# EAGLE board panel_controller_rev_c (EAGLE 9.6.2)
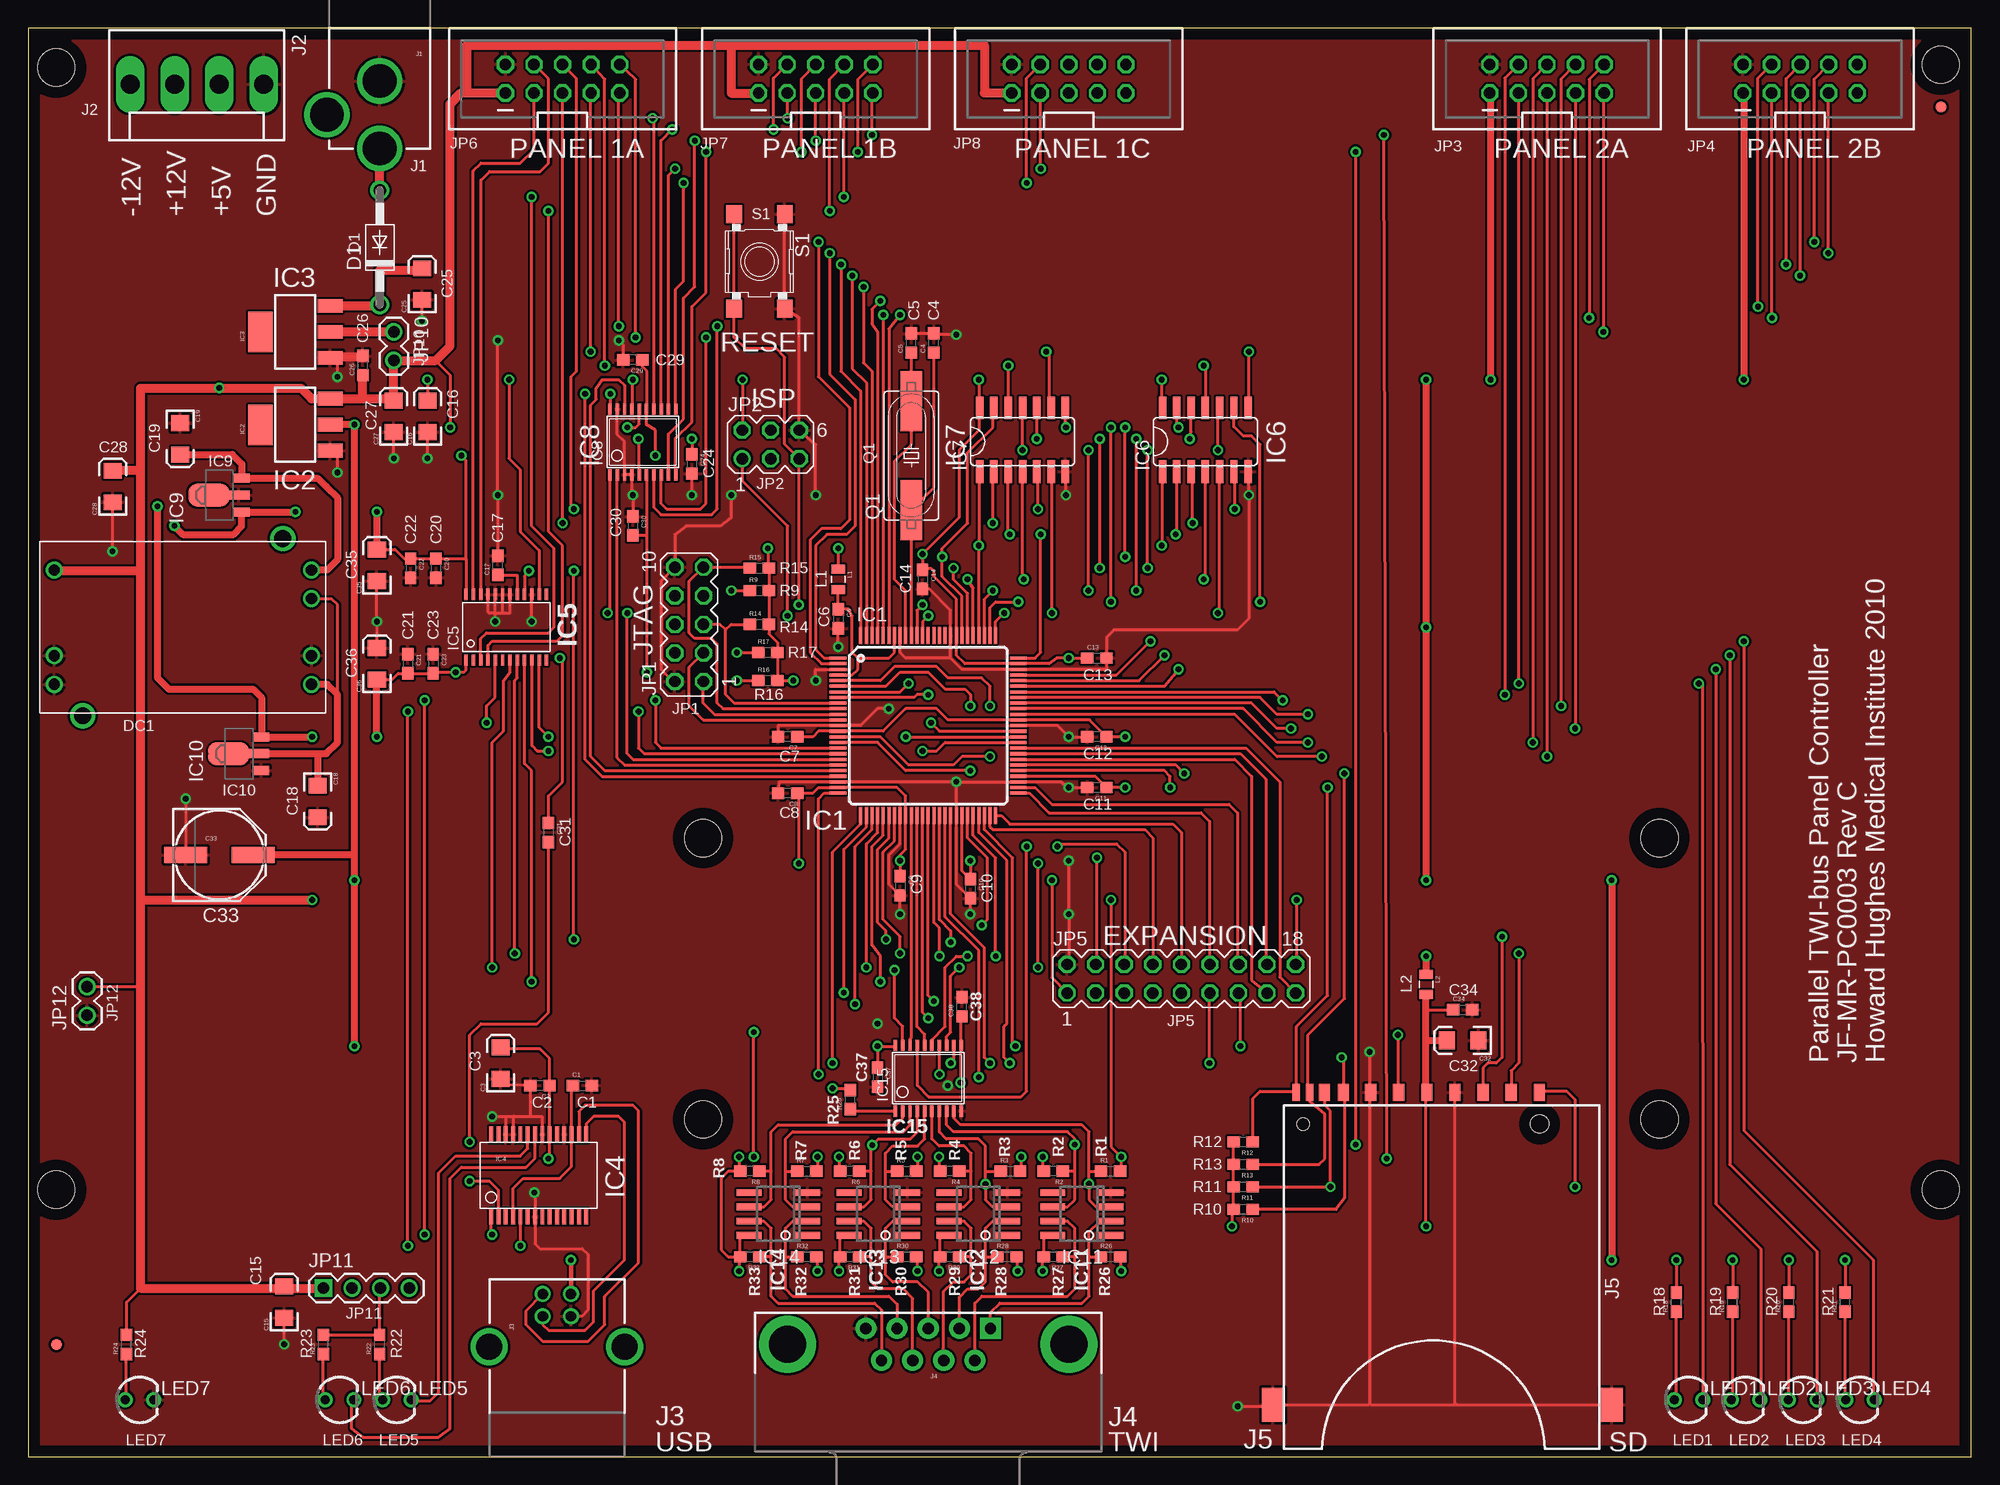
[diagram p2: board, top side]
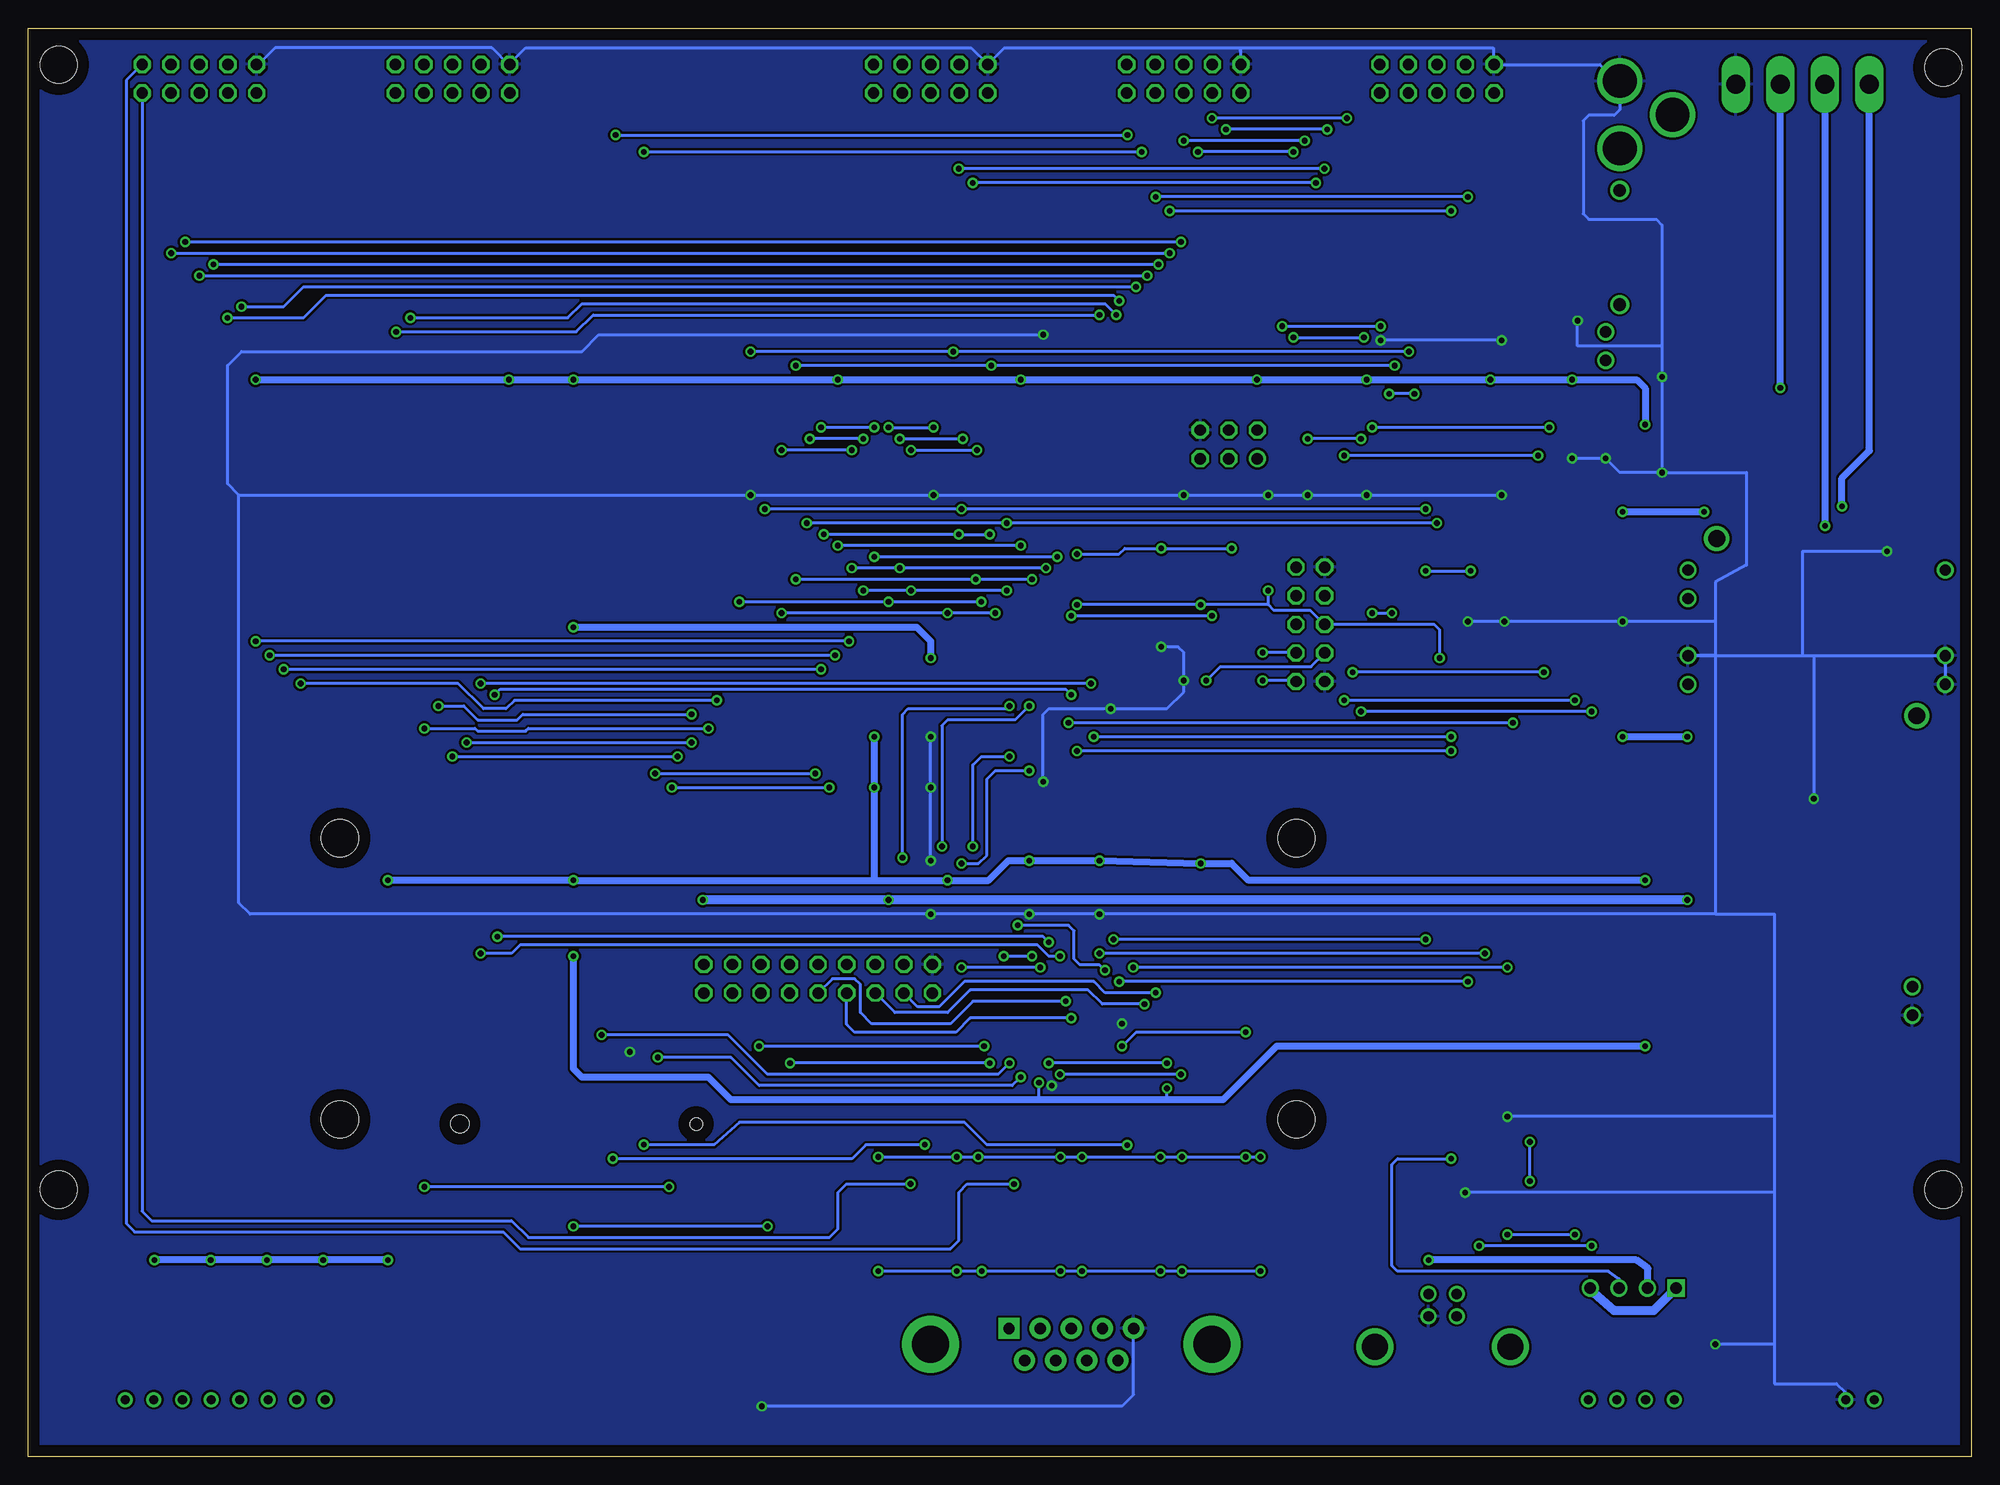
[diagram p3: board, bottom side, seen from below]

Size 172.72 x 127 mm. Coordinates in mm from the lower left corner, seen from the top.
Outline: 0,0 172.72,0 172.72,127 0,127 0,0
Copper layers (1*16): Top 0.035mm / dielectric 1.5mm / Bottom 0.035mm
Design rules "default *": minimum track width 10mil, minimum drill 15mil, track to track 8mil, track to pad 8mil, pad to pad 8mil, via to via 8mil, smd to smd 8mil, copper to edge 40mil, drill to drill 8mil, minimum pad ring 10mil, minimum via ring 8mil, stop-mask expansion 4mil, vias tented up to drill 0mil, thermal gap 10mil
Net classes: 0 default: width 0.203 mm; 1 power: width 0.254 mm

## Footprints (pad centres in the part's own frame; a part is rotated, then mirrored left to right if it is on the bottom)
0603 = smd 1.1 x 1: 1 -0.85,0; 2 0.85,0
EIA3216 = smd 1.4 x 1.6: A 1.4,0; C -1.4,0
PANASONIC_E = smd 3.8 x 1.4: + 3,0; - -3,0
DO41-10 = drill 1.118: A 5.08,0; C -5.08,0
CC3-TH = drill 1: 1 -11.43,5.08; 2 -11.43,-2.54; 3 -11.43,-5.08; 4 11.43,-5.08; 5 11.43,-2.54; 6 11.43,2.54; 7 11.43,5.08 | drill 1.5: P$8 -8.89,-7.874; P$9 8.89,7.874
TQFP100 = smd 1.5 x 0.27: 1 -8,6; 2 -8,5.5; 3 -8,5; 4 -8,4.5; 5 -8,4; 6 -8,3.5; 7 -8,3; 8 -8,2.5; 9 -8,2; 10 -8,1.5; 11 -8,1; 12 -8,0.5; 13 -8,0; 14 -8,-0.5; 15 -8,-1; 16 -8,-1.5; 17 -8,-2; 18 -8,-2.5; 19 -8,-3; 20 -8,-3.5; 21 -8,-4; 22 -8,-4.5; 23 -8,-5; 24 -8,-5.5; 25 -8,-6; 51 8,-6; 52 8,-5.5; 53 8,-5; 54 8,-4.5; 55 8,-4; 56 8,-3.5; 57 8,-3; 58 8,-2.5; 59 8,-2; 60 8,-1.5; 61 8,-1; 62 8,-0.5; 63 8,0; 64 8,0.5; 65 8,1; 66 8,1.5; 67 8,2; 68 8,2.5; 69 8,3; 70 8,3.5; 71 8,4; 72 8,4.5; 73 8,5; 74 8,5.5; 75 8,6 | smd 0.27 x 1.5: 26 -6,-8; 27 -5.5,-8; 28 -5,-8; 29 -4.5,-8; 30 -4,-8; 31 -3.5,-8; 32 -3,-8; 33 -2.5,-8; 34 -2,-8; 35 -1.5,-8; 36 -1,-8; 37 -0.5,-8; 38 0,-8; 39 0.5,-8; 40 1,-8; 41 1.5,-8; 42 2,-8; 43 2.5,-8; 44 3,-8; 45 3.5,-8; 46 4,-8; 47 4.5,-8; 48 5,-8; 49 5.5,-8; 50 6,-8; 76 6,8; 77 5.5,8; 78 5,8; 79 4.5,8; 80 4,8; 81 3.5,8; 82 3,8; 83 2.5,8; 84 2,8; 85 1.5,8; 86 1,8; 87 0.5,8; 88 0,8; 89 -0.5,8; 90 -1,8; 91 -1.5,8; 92 -2,8; 93 -2.5,8; 94 -3,8; 95 -3.5,8; 96 -4,8; 97 -4.5,8; 98 -5,8; 99 -5.5,8; 100 -6,8
SOT223 = smd 1.219 x 2.235: 1 -2.311,-3.099; 2 0,-3.099; 3 2.311,-3.099 | smd 3.6 x 2.2: 4 0,3.099
SSOP28DB = smd 0.348 x 1.397: 1 -4.225,-3.656; 2 -3.575,-3.656; 3 -2.925,-3.656; 4 -2.275,-3.656; 5 -1.625,-3.656; 6 -0.975,-3.656; 7 -0.325,-3.656; 8 0.325,-3.656; 9 0.975,-3.656; 10 1.625,-3.656; 11 2.275,-3.656; 12 2.925,-3.656; 13 3.575,-3.656; 14 4.225,-3.656; 15 4.225,3.656; 16 3.575,3.656; 17 2.925,3.656; 18 2.275,3.656; 19 1.625,3.656; 20 0.975,3.656; 21 0.325,3.656; 22 -0.325,3.656; 23 -0.975,3.656; 24 -1.625,3.656; 25 -2.275,3.656; 26 -2.925,3.656; 27 -3.575,3.656; 28 -4.225,3.656
TSSOP24 = smd 0.305 x 0.991: 1 -3.575,-2.918; 2 -2.925,-2.918; 3 -2.275,-2.918; 4 -1.625,-2.918; 5 -0.975,-2.918; 6 -0.325,-2.918; 7 0.325,-2.918; 8 0.975,-2.918; 9 1.625,-2.918; 10 2.275,-2.918; 11 2.925,-2.918; 12 3.575,-2.918; 13 3.575,2.918; 14 2.925,2.918; 15 2.275,2.918; 16 1.625,2.918; 17 0.975,2.918; 18 0.325,2.918; 19 -0.325,2.918; 20 -0.975,2.918; 21 -1.625,2.918; 22 -2.275,2.918; 23 -2.925,2.918; 24 -3.575,2.918
SO014 = smd 0.66 x 2.032: 1 -3.175,-2.68; 2 -1.905,-2.68; 3 -0.635,-2.68; 4 0.635,-2.68; 5 1.905,-2.68; 6 3.175,-2.68; 7 4.445,-2.68; 8 4.445,2.997; 9 3.175,2.997; 10 1.905,2.997; 11 0.635,2.997; 12 -0.635,2.997; 13 -1.905,2.997; 14 -3.175,2.997
TSSOP20 = smd 0.305 x 0.991: 1 -2.925,-2.918; 2 -2.275,-2.918; 3 -1.625,-2.918; 4 -0.975,-2.918; 5 -0.325,-2.918; 6 0.325,-2.918; 7 0.975,-2.918; 8 1.625,-2.918; 9 2.275,-2.918; 10 2.925,-2.918; 11 2.925,2.918; 12 2.275,2.918; 13 1.625,2.918; 14 0.975,2.918; 15 0.325,2.918; 16 -0.325,2.918; 17 -0.975,2.918; 18 -1.625,2.918; 19 -2.275,2.918; 20 -2.925,2.918
SOT89 = smd 0.8 x 1.4: 1 -1.499,-1.981; 3 1.499,-1.981 | smd 0.8 x 1.9: 2 0,-1.727 | smd 2.032 x 3.65: 2@1 0,0.94
SO08 = smd 0.6 x 2.2: 1 -1.905,-2.6; 2 -0.635,-2.6; 3 0.635,-2.6; 4 1.905,-2.6; 5 1.905,2.6; 6 0.635,2.6; 7 -0.635,2.6; 8 -1.905,2.6
POWER_JACK_PTH = drill 2.997: GND 0,7.7; GNDBREAK 4.7,10.7; PWR 0,13.7
KK-156-4 = drill 1.7 pad 2.184 long: 1 -5.94,0; 2 -1.98,0; 3 1.98,0; 4 5.94,0
USB-B-PTH = drill 0.914: D+ 0,1.25; D- 1.981,1.25; GND 0,-1.25; VBUS 1.981,-1.25 | drill 2.286: P$1 -2.718,-6.02; P$2 -2.718,6.02
DB9 = drill 1.016 pad 1.88 square: 1 -5.54,-1.42 | drill 1.016 pad 1.88: 2 -2.77,-1.42; 3 0,-1.42; 4 2.77,-1.42; 5 5.54,-1.42; 6 -4.15,1.42; 7 -1.38,1.42; 8 1.38,1.42; 9 4.15,1.42 | drill 3.302 pad 5.08: G1 -12.5,0; G2 12.5,0
SD-MMC_SOCKET-3M = smd 1 x 1.5: 1 6.88,29.85; 2 4.38,29.85; 3 1.88,29.85; 4 -0.62,29.85; 5 -3.12,29.85; 6 -5.62,29.85; 7 -8.04,29.85; 8 -9.728,29.85; 9 9.38,29.85 | smd 2 x 3: 12 -14.28,2.1; 13 15.822,2.095 | smd 0.7 x 1.5: CD -11.03,29.855; WP -12.23,29.85 | hole 1.1: -11.6,27.05 | hole 1.6: 9.4,27.05
MA05-2 = drill 1.016 octagon: 1 -5.08,-1.27; 2 -5.08,1.27; 3 -2.54,-1.27; 4 -2.54,1.27; 5 0,-1.27; 6 0,1.27; 7 2.54,-1.27; 8 2.54,1.27; 9 5.08,-1.27; 10 5.08,1.27
MA03-2 = drill 1.016: 1 -2.54,-1.27 | drill 1.016 octagon: 2 -2.54,1.27; 3 0,-1.27; 4 0,1.27; 5 2.54,-1.27; 6 2.54,1.27
2X5-SHROUDED = drill 1.016 octagon: 1 -1.27,5.08; 2 1.27,5.08; 3 -1.27,2.54; 4 1.27,2.54; 5 -1.27,0; 6 1.27,0; 7 -1.27,-2.54; 8 1.27,-2.54; 9 -1.27,-5.08; 10 1.27,-5.08
MA09-2 = drill 1.016 octagon: 1 -10.16,-1.27; 2 -10.16,1.27; 3 -7.62,-1.27; 4 -7.62,1.27; 5 -5.08,-1.27; 6 -5.08,1.27; 7 -2.54,-1.27; 8 -2.54,1.27; 9 0,-1.27; 10 0,1.27; 11 2.54,-1.27; 12 2.54,1.27; 13 5.08,-1.27; 14 5.08,1.27; 15 7.62,-1.27; 16 7.62,1.27; 17 10.16,-1.27; 18 10.16,1.27
1X02 = drill 1.016: 1 0,0; 2 2.54,0
1X04 = drill 1.016 square: 1 0,0 | drill 1.016: 2 2.54,0; 3 5.08,0; 4 7.62,0
0805 = smd 0.8 x 1.2: 1 -0.9,0; 2 0.9,0
LED3MM = drill 0.813: A -1.27,0; K 1.27,0
HC49UP = smd 5.334 x 1.93: 1 -4.826,0; 2 4.826,0
OMRON = smd 1.6 x 1.4: 1 -4.2,2.25; 2 4.2,2.25; 3 -4.2,-2.25; 4 4.2,-2.25
FIDUCIAL-1X2 = smd 1 x 1: 1 0,0
STAND-OFF = hole 3.302: 0,0

## Placement (x,y rotation side)
C1  .1uf  [0603]  49.25,33 0 top
C2  .1uf  [0603]  45.5,33 180 top
C3  10uf  [EIA3216]  42,35 90 top
C4  22pf  [0603]  80.5,99 90 top
C5  22pf  [0603]  78.5,99 90 top
C6  .1uf  [0603]  72,74.5 270 top
C7  .1uf  [0603]  67.5,64 180 top
C8  .1uf  [0603]  67.5,59 180 top
C9  .1uf  [0603]  77.5,50.75 270 top
C10  .1uf  [0603]  83.75,50.5 270 top
C11  .1uf  [0603]  95,59.5 180 top
C12  .1uf  [0603]  95,64 180 top
C13  .1uf  [0603]  95,71 0 top
C14  .1uf  [0603]  79.5,78 270 top
C15  10uf  [EIA3216]  22.75,13.75 90 top
C16  10uf  [EIA3216]  35.5,92.5 90 top
C17  .01uf  [0603]  41.75,79.25 90 top
C18  10uf  [EIA3216]  25.75,58.25 270 top
C19  10uf  [EIA3216]  13.5,90.5 270 top
C20  .1uf  [0603]  36.25,79 270 top
C21  .1uf  [0603]  33.75,70.5 270 top
C22  22pf  [0603]  34,79 270 top
C23  22pf  [0603]  36,70.5 270 top
C24  680pf  [0603]  59,88.25 270 top
C25  10uf  [EIA3216]  35,104.25 90 top
C26  .1uf  [0603]  29.75,97 90 top
C27  10uf  [EIA3216]  32.5,92.5 90 top
C28  10uf  [EIA3216]  7.5,86.25 90 top
C29  .1uf  [0603]  53.75,97.5 180 top
C30  .1uf  [0603]  53.75,82.75 270 top
C31  .1uf  [0603]  46.25,55.5 270 top
C32  10uf  [EIA3216]  127.5,37 180 top
C33  100uf  [PANASONIC_E]  17,53.5 0 top
C34  .1uf  [0603]  127.5,39.75 0 top
C35  10uf  [EIA3216]  31,79.25 90 top
C36  10uf  [EIA3216]  31,70.5 90 top
C37  .1uf  [0603]  75.5,33.75 270 top
C38  .1uf  [0603]  83,40 90 top
D1  1N4004  [DO41-10]  31.25,107.5 90 top
DC1  CC3-0512DF-E  [CC3-TH]  13.75,73.75 0 top
IC1  AVR_XMEGA_A1_100A  [TQFP100]  80,65 0 top
IC2  LM1117-3.3  [SOT223]  23.75,91.75 90 top
IC3  LM1117-5  [SOT223]  23.75,100 90 top
IC4  FT232RL-BASICSSOP  [SSOP28DB]  45.38,25.01 0 top
IC5  AD5724SSOP  [TSSOP24]  42.5,73.75 0 top
IC6  74LVC125SO  [SO014]  104,90.25 0 top
IC7  74LVC126SO  [SO014]  87.75,90.25 0 top
IC8  AD7328SSOP  [TSSOP20]  54.64,90.21 0 top
IC9  78L12  [SOT89]  17,85.5 90 top
IC10  79L12  [SOT89]  18.75,62.5 90 top
IC11  82B715TD  [SO08]  93.66,21.59 90 top
IC12  82B715TD  [SO08]  84.45,21.59 90 top
IC13  82B715TD  [SO08]  75.56,21.59 90 top
IC14  82B715TD  [SO08]  66.67,21.59 90 top
IC15  PCA9519  [TSSOP20]  80.01,33.66 0 top
J1  POWER_JACKPTH  [POWER_JACK_PTH]  31.25,130 180 top
J2  [KK-156-4]  15,122 180 top
J3  USBPTH  [USB-B-PTH]  47,12.5 90 top
J4  [DB9]  80,10 180 top
J5  SD-CARD-SOCKET  [SD-MMC_SOCKET-3M]  124.94,2.54 0 top
JP1  M05X2PTH  [MA05-2]  58.75,74 90 top
JP2  PDI  [MA03-2]  66,90 0 top
JP3  M05X2SHD  [2X5-SHROUDED]  135,122.5 90 top
JP4  M05X2SHD  [2X5-SHROUDED]  157.5,122.5 90 top
JP5  [MA09-2]  102.5,42.5 0 top
JP6  M05X2SHD  [2X5-SHROUDED]  47.5,122.5 90 top
JP7  M05X2SHD  [2X5-SHROUDED]  70,122.5 90 top
JP8  M05X2SHD  [2X5-SHROUDED]  92.5,122.5 90 top
JP10  [1X02]  32.5,100 270 top
JP11  [1X04]  26.25,15 0 top
JP12  [1X02]  5.25,39.25 90 top
L1  10uH  [0805]  72,78 270 top
L2  22uH  [0805]  124.25,42 270 top
LED1  [LED3MM]  147.57,5.08 0 top
LED2  [LED3MM]  152.65,5.08 0 top
LED3  [LED3MM]  157.73,5.08 0 top
LED4  [LED3MM]  162.81,5.08 0 top
LED5  [LED3MM]  32.77,5.08 0 top
LED6  [LED3MM]  27.69,5.08 0 top
LED7  PWR  [LED3MM]  9.91,5.08 0 top
Q1  8MHz  [HC49UP]  78.5,89 90 top
R1  2.2K  [0603]  96.2,25.4 0 top
R2  2.2K  [0603]  91.12,25.4 180 top
R3  2.2K  [0603]  87.31,25.4 0 top
R4  2.2K  [0603]  81.92,25.4 180 top
R5  2.2K  [0603]  78.11,25.4 0 top
R6  2.2K  [0603]  73.03,25.4 180 top
R7  2.2K  [0603]  69.22,25.4 0 top
R8  2.2K  [0603]  64.14,25.4 180 top
R9  10K  [0603]  65,77 0 top
R10  100K  [0603]  108,22 180 top
R11  100K  [0603]  108,24 180 top
R12  100K  [0603]  108,28 180 top
R13  100K  [0603]  108,26 180 top
R14  10K  [0603]  65,74 0 top
R15  10K  [0603]  65,79 0 top
R16  10K  [0603]  65.75,69 0 top
R17  10K  [0603]  65.75,71.5 0 top
R18  100  [0603]  146.5,13.75 90 top
R19  100  [0603]  151.5,13.75 90 top
R20  100  [0603]  156.5,13.75 90 top
R21  100  [0603]  161.5,13.75 90 top
R22  330  [0603]  31.25,10 90 top
R23  330  [0603]  26.25,10 90 top
R24  330  [0603]  8.75,10 90 top
R25  10K  [0603]  73.06,31.75 90 top
R26  470  [0603]  96.2,17.78 0 top
R27  470  [0603]  91.12,17.78 180 top
R28  470  [0603]  87,17.78 0 top
R29  470  [0603]  81.92,17.78 180 top
R30  470  [0603]  78.11,17.78 0 top
R31  470  [0603]  73.03,17.78 180 top
R32  470  [0603]  69.22,17.78 0 top
R33  470  [0603]  64.14,17.78 180 top
S1  [OMRON]  65,106.25 270 top
U$1  FIDUCIAL1X2  [FIDUCIAL-1X2]  2.5,10 0 top
U$2  FIDUCIAL1X2  [FIDUCIAL-1X2]  170,120 0 top
U$3  STAND-OFF  [STAND-OFF]  2.5,123.5 0 top
U$4  STAND-OFF  [STAND-OFF]  170,123.75 0 top
U$5  STAND-OFF  [STAND-OFF]  2.5,23.75 0 top
U$6  STAND-OFF  [STAND-OFF]  170,23.75 0 top
U$7  STAND-OFF  [STAND-OFF]  60,55 0 top
U$8  STAND-OFF  [STAND-OFF]  60,30 0 top
U$9  STAND-OFF  [STAND-OFF]  145,30 0 top
U$10  STAND-OFF  [STAND-OFF]  145,55 0 top

## Tracks (layer width: path | path; a pad name or v marks a point on that pad's centre or on a via)
+3V3  (via drill 0.51)
  Top 0.254: v146.5,17.5 R18.2 | v151.5,17.5 R19.2 | v156.5,17.5 R20.2 | v161.5,17.5 R21.2 | IC1.44 83,52.1 C10.1 v83.75,53 | IC1.54 94.85,60.5 C11.1 v97.5,59.5 | C13.1 v92.5,71 91.4,71 90.75,70.5 IC1.74 83.25,70.5 82.5,71.25 IC1.83 82.5,76.25 80.5,78.25 80.5,78.75 80.25,79 79.75,79 C14.1 v79.5,80.25 82.75,83.5 82.75,89.5 84.5,91.25 84.5,93.17 IC7.14 84.5,93.32 v84.5,95.75 | v72,80.75 L1.1 | IC6.14 100.75,93.32 v100.75,95.75 | C9.1 v77.5,53 77.5,53.5 78,54 IC1.34 78,58.75 77.25,59.5 IC1.24 70.25,59.5 69.75,59 C8.1 68.5,58.85 v68.5,52.75 | JP5.1 91,42.61 v91,51.25 | v124.25,51.25 124.32,51.18 | v97.5,64 C12.1 94.35,65.5 IC1.64 81.75,65.5 80.75,66.5 78,66.5 76,64.5 IC1.14 70.25,64.5 69.75,64 C7.1 | JP4.1 152.5,121.15 | 130,121.15 JP3.1 | v63.5,95.75 63.5,91.31 JP2.2 | IC8.17 53.66,95.67 v53.75,95.75 | v65.75,80.75 65.75,79.1 R15.2 R9.2 R14.2 65.85,73.15 66.6,72.4 R17.2 R16.2 v68,69 | v35.5,95.75 C16.A | v42.75,95.75 42.75,88.75 43.75,87.75 43.75,82.25 45.42,80.58 IC5.14 | v82.87,33.27 82.94,33.34 IC15.11 82.94,39.09 C38.1 | R25.2 72.92,32.75 v71.5,32.75
  Top 0.61: v124.25,95.75 v124.25,73.75 v124.25,51.25 | 152.5,121.15 v152.5,95.75 | v130,95.75 130,121.15 | 29,53.5 v29,51.25 v29,36.5 | 29,53.5 v29,91.75 IC2.2 | 29,53.5 C33.+ | 124.32,51.18 124.25,51.18 | v140.75,51.25 v140.75,17.5 | v124.25,44.5 L2.1
  Bottom 0.254: v79.5,80.25 75.75,80.25 75.25,80.75 v72,80.75 v65.75,80.75 | v68,69 66.75,70.25 58.69,70.25 JP1.4 | 82.87,31.75 v82.87,33.27 | 71.5,31.75 v71.5,32.75
  Bottom 0.61: v140.75,17.5 v146.5,17.5 v151.5,17.5 v156.5,17.5 v161.5,17.5 | v152.5,95.75 v130,95.75 v124.25,95.75 v100.75,95.75 v84.5,95.75 v63.5,95.75 v53.75,95.75 v42.75,95.75 v35.5,95.75 29.75,95.75 29,95 v29,91.75 | 97.5,51.25 v124.25,51.25 v140.75,51.25 | 97.5,51.25 v91,51.25 87.34,51.25 85.59,53 v83.75,53 v77.5,53 v68.5,52.75 65.75,52.75 64.25,51.25 v29,51.25 | v97.5,64 v97.5,59.5 97.5,51.25 | v124.25,73.75 93.75,73.75 92.5,72.5 v92.5,71 | v124.25,44.5 124.25,34.5 123.5,33.75 112.25,33.75 110.25,31.75 82.87,31.75 71.5,31.75 66.5,31.75 61.75,36.5 v29,36.5
+5V  (via drill 0.51)
  Top 0.254: 32.34,94.06 C27.A | 27.69,94.06 IC2.3 | C15.A 22.65,15 23.25,15 | 42.4,121.25 JP6.1 | IC8.16 54.31,91.81 54,91.5 v53.25,91.5 | v37.5,91.5 37.5,96.17 36.21,97.46 | v112.75,49.5 112.75,43.86 JP5.18 | R24.2 8.75,13.75 10,15 | JP12.2 9.96,41.79 10,41.75 | R26.2 97.16,17.68 v97.16,16.51 | v63.18,16.51 63.18,17.68 R33.2 | v72.07,16.51 72.07,17.68 R31.2 72.17,19.68 IC13.8 | v80.96,16.51 80.96,17.68 R29.2 81.06,19.68 IC12.8 | v90.17,16.51 90.17,17.68 R27.2 90.27,19.68 IC11.8 | R32.2 70.17,17.68 v70.17,16.51 | R30.2 79.06,17.68 v79.06,16.51 | R28.2 87.95,17.68 v87.95,16.51 | R1.2 97.16,25.5 v97.16,26.67 96.25,27.57 v96.25,49.5 | v63.18,26.67 63.18,25.4 R8.2 62.23,25.4 61.59,24.77 61.59,18.41 62.23,17.78 R33.2 | R7.2 70.17,25.4 v70.17,26.67 | R6.2 72.07,25.4 v72.07,26.67 | R5.2 79.06,25.4 v79.06,26.67 | R4.2 80.96,25.4 v80.96,26.67 | R3.2 88.27,25.4 v88.27,26.67 | R2.2 90.17,25.4 v90.17,26.67 | IC15.20 arc-90 77.01,36.5 v75.5,36.5 C37.1 | v64.5,26.67 v64.5,37.75 | IC14.8 63.28,19.68 R33.2
  Top 0.61: 17,95 v16.98,95.02
  Top 0.813: 29.75,94.06 27.69,94.06 25.19,94.06 24.25,95 17,95 10,95 10,87.75 | 29.75,94.06 32.34,94.06 | C27.A JP10.2 36.21,97.46 37.5,98.75 37.5,120.25 38.5,121.25 38.75,121.25 | 29.75,94.06 C26.1 | JP11.1 23.25,15 10,15 10,41.75 10,49.5 | 38.75,121.25 42.4,121.25 | 10,49.5 v25.25,49.5 | 38.75,121.25 39,121.25 39,125.5 62.5,125.5 | 62.5,125.5 85,125.5 85,121.25 87.42,121.25 JP8.1 | JP7.1 62.5,121.23 62.5,125.5 | 10,49.5 10,78.75 | 10,78.75 10,87.75 | 10,78.75 2.4,78.75 DC1.1 | C28.A 9.9,87.65 10,87.75
  Bottom 0.254: 33.87,14.87 JP11.4 | v37.5,91.5 v53.25,91.5 | JP8.1 87.42,121.33 | v63.18,16.51 v70.17,16.51 v72.07,16.51 v79.06,16.51 v80.96,16.51 v87.95,16.51 v90.17,16.51 v97.16,16.51 | v63.18,26.67 v64.5,26.67 v70.17,26.67 v72.07,26.67 v79.06,26.67 v80.96,26.67 v88.27,26.67 v90.17,26.67 v97.16,26.67 | v75.5,36.5 74.25,37.75 v64.5,37.75
  Bottom 0.61: v16.98,95.02 J2.2
  Bottom 0.813: 33.87,14.87 31.75,13 28.25,13 JP11.1 | v25.25,49.5 v96.25,49.5 v112.75,49.5
+12V  (via drill 0.51)
  Top 0.254: v55.75,89 55.75,91.25 54.97,91.75 IC8.15 55,93.16 55,96.5 54.6,96.9 C29.1 | 38.92,79.75 IC5.24 | 38.92,79.75 arc90 38.83,79.85 C20.1 C22.1 33.4,79.85 32.6,80.65 C35.A | 38.92,79.75 38.92,88.58 v38.5,89
  Top 0.61: v23.75,84 IC9.1 18.98,82.73 18.25,82 13.75,82 v13,82.75 | v31,84 C35.A
  Bottom 0.254: v38.5,89 v55.75,89
  Bottom 0.61: v23.75,84 v31,84 | v13,82.75 13,121.98 J2.3
+15V
  Top 0.61: DC1.7 26.58,78.83 27.5,79.75 27.5,85.25 26.5,86.25 25.73,87 IC9.3 19,87.02 19,88.25 18.15,89.1 C19.A
-12V  (via drill 0.51)
  Top 0.254: IC8.6 55,87.26 55,82 | v55,69.75 55,82 | IC5.1 38.92,69.92 38.75,69.75 v38,69.75 36.1,69.75 C23.2 C21.2 32.9,69.65 32.35,69.1 C36.C | C30.2 54.9,81.9 55,82
  Top 0.61: v25.25,64 IC10.3 20.75,64.02 20.75,67.5 20,68.25 12.5,68.25 11.5,69.25 v11.5,84.5 | v31,64 C36.C
  Bottom 0.254: v38,69.75 v55,69.75
  Bottom 0.61: v25.25,64 v31,64 | J2.4 9.06,89.44 11.5,87 v11.5,84.5
-15V
  Top 0.254: DC1.6 25.22,76.25 27,76.25 27.5,75.75 27.5,67.75
  Top 0.61: DC1.4 26.58,68.67 27.5,67.75 27.5,63.5 26.5,62.5 25.75,62.5 | IC10.2 25.75,62.5 | 25.75,62.5 C18.C
GND  (via drill 0.51)
  Top 0.254: 119.25,32.32 J5.6 | 119.25,4.75 119.25,32.32 | 119.25,4.75 119.14,4.64 J5.12 110.52,4.5 v107.5,4.5 | 140.65,4.75 J5.13 127,4.63 | 119.25,4.75 119.36,4.63 127,4.63 | J5.3 126.82,4.63 127,4.63 | 82.5,56.75 82.5,50.9 C10.2 v83.75,48.25 | 82.5,56.75 IC1.43 | 119.25,32.32 v119.25,36 | JP5.2 92.5,43.89 v92.5,48.25 v92.5,53 | C14.2 80.1,77.15 82,75.25 IC1.84 82,71 | 82,71 83,70 IC1.73 95.85,70 C13.2 95.85,72.85 96.5,73.5 107.5,73.5 108.5,74.5 v108.5,85.5 108.5,87.52 IC6.7 | IC1.93 77.5,71.5 78,71 82,71 | IC7.7 92.25,87.52 v92.25,85.5 | C5.2 C4.2 80.6,99.75 v82.5,99.75 | IC1.33 77.5,54.5 76.5,53.5 76.5,50.9 C9.2 v77.5,48.25 | C11.2 v92.5,59.5 91.75,60 IC1.53 v82.5,60 | IC1.63 91.5,65 v92.5,64 C12.2 | C8.2 66.65,59.15 66.75,60 IC1.23 v82.5,60 | 82.5,56.75 v82.5,60 | v70,85.5 70,89.98 JP2.6 68.54,101.26 S1.2 S1.1 | v59,85.5 C24.2 | IC8.19 52.37,90.89 53.02,90.23 IC8.3 IC8.4 53.66,85.58 v53.75,85.5 C30.1 | C7.2 66.65,65 IC1.13 74,65 75.5,66.5 v76.5,66.5 | JP1.2 57.33,68.92 56.25,70 56.25,77.85 JP1.10 57.5,79.1 57.5,82 58.5,82.75 61.5,82.75 62.5,83.5 v62.5,85.5 | C17.2 v41.75,85.5 v41.75,99.25 | v27.5,87.5 27.5,89.29 IC2.1 | v32.5,88.75 C27.C | IC3.1 27.5,97.79 v27.5,96 | v35.5,88.75 C16.C | IC5.15 44.75,76.64 v44.75,74.25 | 41.5,75 41,75 40.88,75.12 IC5.21 | 41.5,75 42.25,75 | IC5.20 41.5,76.64 41.5,75 | IC5.19 42.17,75 42.25,75 | IC5.18 42.83,75 42.25,75 | v41.5,74.25 41.5,75 | 29.31,97.79 C26.2 | v22.75,10 C15.C | C3.C 42.1,33.05 C2.2 44.65,30.25 44.75,30.25 | IC4.21 45.7,30.25 44.75,30.25 | 43.25,30.25 42.5,30.25 42.5,28.67 IC4.26 42.45,30.25 v41.25,30.25 | 43.25,30.25 44.75,30.25 | IC4.25 43.1,30.25 43.25,30.25
  Top 0.254: v45,23.5 45.05,23.5 IC4.7 45.05,18.95 45.5,18.5 49.25,18.5 49.75,18 49.75,13.06 49.25,12.5 J3.GND | v35,101 C25.C | v72,72 C6.2 | IC1.3 70,70 v70,69 | v7.5,80.5 C28.C | C29.2 52.9,98.85 v52.5,99.25 | C35.C v31,74.25 C36.A | v14,58.5 C33.-
  Top 0.813: 27.5,97.79 29.31,97.79
  Bottom 0.254: J4.5 74.46,5.54 75.5,4.5 v107.5,4.5 | v92.5,64 v92.5,59.5 v92.5,53 | v82.5,60 82.5,66 82,66.5 v76.5,66.5 71.5,66.5 70,68 v70,69 70,71.5 70.5,72 v72,72 | v41.75,85.5 v53.75,85.5 v59,85.5 v62.5,85.5 v70,85.5 v92.25,85.5 v108.5,85.5 154,85.5 | 22.75,48.25 v77.5,48.25 v83.75,48.25 v92.5,48.25 153,48.25 154,49.25 154,85.5 | 22.75,71.25 22.75,48.25 | 22.75,74.25 22.75,71.25 | 22.75,74.25 22.75,77.75 20,79.25 20,87.5 v27.5,87.5 | v27.5,87.5 31.25,87.5 v32.5,88.75 v35.5,88.75 | v27.5,87.5 v27.5,96 27.5,98.75 | 22.75,74.25 v31,74.25 31,74.5 31.25,74.25 v41.5,74.25 v44.75,74.25 | DC1.3 DC1.2 13.97,71.21 | 15,71.21 DC1.5 25.22,71.25 22.75,71.25 | 15,71.21 13.97,71.21 | 22.75,48.25 17.5,48.25 17.5,30.25 | 17.5,30.25 17.5,23.5 | 17.5,23.5 17.5,10 | 17.5,10 v22.75,10 | 17.5,30.25 v41.25,30.25 | 17.5,23.5 v45,23.5 | 152.25,123.75 150.75,125.25 131.5,125.25 130,123.75 128.5,125.25 88.9,125.25 JP8.2 85.94,125.25 65,125.25 64.92,123.92 JP7.2 64.92,125.25 42.5,125.25 42.5,123.77 JP6.2 42.4,123.75 33,123.75 32.5,123.25 J1.GND 31.25,119.75 31.75,119.25 34,119.25 34.5,118.75 34.5,110.5 34,110 28,110 27.5,109.5 27.5,98.75 | v82.5,99.75 122,99.75 123.5,98.25 153.75,98.25 155,97 155,86.5 154,85.5 | 15,71.21 15,80.5 v7.5,80.5 | LED7.K 11.27,5.77 12,6.5 17.5,6.5 17.5,10 | v41.75,99.25 v52.5,99.25 | v35,101 35,98.75 27.5,98.75 | 13.97,71.21 14,71.18 v14,58.5
  other vias: 81.75,33 75.5,38.5
  pour Top: 0,0 0,127 172.72,127 172.72,0
  pour Bottom: 0,0 0,127 172.72,127 172.72,0
JTAG-TCK  (via drill 0.51)
  Top 0.254: IC1.11 61,66 60,67 60,68.9 JP1.1 | v63,69 R16.1
  Bottom 0.254: v63,69 60.1,69 JP1.1
JTAG-TDI
  Top 0.254: IC1.10 61.75,66.5 61.25,67 61.25,72.25 60.75,72.75 59.25,72.75 58.75,73.25 58.75,77.85 JP1.9 64.07,79.08 R15.1
JTAG-TDO  (via drill 0.51)
  Top 0.254: IC1.12 60,65.5 58.75,66.75 58.75,70.19 JP1.3 | v63,71.5 R17.1
  Bottom 0.254: v63,71.5 60.06,71.5 JP1.3
JTAG-TMS
  Top 0.254: IC1.9 62.75,67 62,67.75 62,73.52 | 62,73.52 61.5,74 JP1.5 | R14.1 62.48,74 62,73.52
N$9
  Top 0.254: IC4.16 48.95,30.7 49.5,31.25 53.75,31.25 54.25,30.75 54.25,17.25 51.25,14.25 51.25,11.75 49.75,10.25 45.75,10.25 44.25,11.75 44.25,12.98 J3.D-
N$10
  Top 0.254: IC4.15 49.6,29.61 50.25,30.25 52.5,30.25 53,29.75 53,17.5 50.25,14.75 50.25,12 49.5,11.25 46.25,11.25 45.75,11.75 J3.D+
N$11  (via drill 0.51)
  Top 0.406: v48.25,17.5 J3.VBUS
  Bottom 0.254: JP11.2 28.75,15
  Bottom 0.61: v48.25,17.5 29.79,17.5 28.75,16.75 28.75,15
N$12
  Top 0.254: 48.3,32.91 C1.1 48.3,33 IC4.17 48.3,25.8 47.25,24.75 44,24.75 43.1,23.86 IC4.4
N$13  (via drill 0.51)
  Top 0.254: IC1.18 54.75,62.5 54.25,63 v54.25,66.25 | v33.75,18.75 v33.75,66.25 | v43.75,18.75 43.76,19.5 IC4.5
  Bottom 0.254: v33.75,66.25 v54.25,66.25 | v33.75,18.75 v43.75,18.75
N$14  (via drill 0.51)
  Top 0.254: IC1.19 53.75,62 53.25,62.5 v53.25,75 | v51.5,75 51.72,75.22 IC8.1
  Bottom 0.254: v53.25,75 v51.5,75
N$15
  Top 0.254: IC1.57 107.25,62 108.75,60.5 108.75,42.36 JP5.15
N$16  (via drill 0.51)
  Top 0.254: IC1.65 107.25,66 111,62.25 v115,62.25 | JP3.5 v135,62.25
  Bottom 0.254: v135,62.25 v115,62.25
N$17  (via drill 0.51)
  Top 0.254: IC1.67 108.75,67 111,64.75 v112.25,64.75 | v137.5,64.75 137.5,121.19 JP3.7
  Bottom 0.254: v137.5,64.75 133,64.75 132.75,64.5 128.5,64.5 128.25,64.75 v112.25,64.75
N$18  (via drill 0.51)
  Top 0.254: IC1.17 56.25,63 55.75,63.5 v55.75,67.25 | v35.25,19.75 v35.25,67.25 | 41.16,21.25 IC4.1 41.16,19.84 v41.25,19.75
  Bottom 0.254: v35.25,67.25 v55.75,67.25 | v35.25,19.75 v41.25,19.75
N$19
  Top 0.254: R22.1 31.23,9.15 31.23,5.37 LED5.A
N$20  (via drill 0.51)
  Top 0.254: 129.25,32.32 J5.2 129.32,34.57 129.75,35 130.5,35 131,35.5 v131,46.25 | v82,45.75 82,46.75 81,47.75 IC1.40
  Bottom 0.254: v82,45.75 82.5,46.25 v131,46.25
N$21  (via drill 0.51)
  Top 0.254: v84.5,33.75 84.5,45 81.5,48 IC1.41 | R10.1 116.25,22 117,23 117,32.29 J5.7 116.9,35.35 v116.75,35.5
  Bottom 0.254: v84.5,33.75 85.25,33 107.75,33 110.25,35.5 v116.75,35.5
N$22  (via drill 0.51)
  Top 0.254: J5.5 121.75,32.32 v121.75,37.5 | v85.5,35 85,35.5 85,45.25 82,48.25 IC1.42
  Bottom 0.254: v85.5,35 86.5,34 107,34 110.5,37.5 v121.75,37.5
N$23  (via drill 0.51)
  Top 0.254: 131.75,32.32 J5.1 131.82,34.32 132.5,35 v132.5,44.75 | v81,44.5 81,47 80.5,47.5 IC1.39
  Bottom 0.254: v81,44.5 82,44.5 83,45.5 129,45.5 129.75,44.75 v132.5,44.75
N$24  (via drill 0.51)
  Top 0.254: IC1.69 110.75,68 v111.5,67.25 | v148.5,68.75 148.82,68.57 LED1.K
  Bottom 0.254: v111.5,67.25 129.5,67.25 130.25,66.5 132.25,66.5 134.5,68.75 v148.5,68.75
N$25  (via drill 0.51)
  Top 0.254: IC1.70 101,68.5 v102.25,70 | v150,70 150,22.5 154,18.5 154,5.18 LED2.K
  Bottom 0.254: v102.25,70 v150,70
N$26
  Top 0.254: IC1.91 Q1.1 80.5,86.17 C4.1
N$27
  Top 0.254: IC1.92 78,77 77,78 77,88.5 78.5,90 Q1.2 C5.1
N$28  (via drill 0.51)
  Top 0.254: IC1.71 98.75,69 v101,71.25 | v151.25,71.25 151.25,26 159,18.25 159,5.1 LED3.K
  Bottom 0.254: v101,71.25 v151.25,71.25
N$29  (via drill 0.51)
  Top 0.254: IC1.72 96.75,69.5 v99.75,72.5 | LED4.K 164,5.14 164,17.5 152.5,29 v152.5,72.5
  Bottom 0.254: v99.75,72.5 v152.5,72.5
N$30
  Top 0.254: R18.1 146.5,5.3 LED1.A
N$31
  Top 0.254: IC1.94 77,71.5 76.5,71 73.75,71 | 73.75,71 73.25,71.5 73.25,74.75 72.9,75.35 C6.1 L1.2 | IC1.4 73.25,69.5 73.75,70 73.75,71
N$32
  Top 0.254: R19.1 151.5,5.22 LED2.A
N$33
  Top 0.254: R20.1 156.5,5.14 LED3.A
N$34
  Top 0.254: R21.1 161.5,5.1 LED4.A
N$35  (via drill 0.51)
  Top 0.254: IC1.66 108,66.5 111,63.5 v113.75,63.5 | v133.75,63.5 133.75,122.52 JP3.6
  Bottom 0.254: v133.75,63.5 v113.75,63.5
N$36  (via drill 0.51)
  Top 0.254: IC1.68 109.5,67.5 111,66 v113.75,66 | v136.25,66.75 136.25,122.48 JP3.8
  Bottom 0.254: v136.25,66.75 134,66.75 132.75,65.5 129.25,65.5 128.75,66 v113.75,66
N$37  (via drill 0.51)
  Top 0.254: IC1.2 70.5,70.5 69.5,71.5 69.5,81.5 70.5,82.5 72.25,82.5 73,83.25 73,93.25 70.25,96 v70.25,108 | v158.75,108 158.75,122.48 JP4.8
  Bottom 0.254: v158.75,108 v70.25,108
N$38  (via drill 0.51)
  Top 0.254: IC1.1 70.75,71 70,71.75 70,81 71,82 72.75,82 73.5,82.75 73.5,94 71.25,96.25 v71.25,107 | v160,107 160,121.19 JP4.7
  Bottom 0.254: v160,107 v71.25,107
N$39  (via drill 0.51)
  Top 0.254: IC1.100 74,94.75 72.25,96.5 v72.25,106 | v156.25,106 156.25,122.52 JP4.6
  Bottom 0.254: v156.25,106 v72.25,106
N$40  (via drill 0.51)
  Top 0.254: R11.1 v115.75,24 115.75,30.75 115.25,31.25 J5.8 | v137.5,24 137.5,31.75 136.75,32.5 134.43,32.5 arc90 J5.9
  Bottom 0.254: v115.75,24 v137.5,24
N$41  (via drill 0.51)
  Top 0.254: R12.1 108.85,31.85 109.5,32.5 112.6,32.5 arc-90 J5.WP 112.75,32.43 112.75,38.25 115.5,41 v115.5,59.5 | IC1.55 101,61 101.5,60.5 v101.5,59.5
  Bottom 0.254: v115.5,59.5 v101.5,59.5
N$42  (via drill 0.51)
  Top 0.254: R13.1 114.75,26 115.25,26.5 115.25,30.5 113.91,31.59 J5.CD 113.75,32.55 113.75,37.5 117,40.75 v117,60.75 | IC1.56 102,61.5 v102.75,60.75
  Bottom 0.254: v117,60.75 v102.75,60.75
N$43  (via drill 0.51)
  Top 0.254: IC1.99 74.5,95.5 73.25,96.75 v73.25,105 | v157.5,105 JP4.5
  Bottom 0.254: v157.5,105 v73.25,105
N$44  (via drill 0.51)
  Top 0.254: IC1.98 75,96.5 74.25,97.25 v74.25,104 | v153.75,102.25 153.75,122.56 JP4.4
  Bottom 0.254: v153.75,102.25 150,102.25 148.25,104 v74.25,104
N$45  (via drill 0.51)
  Top 0.254: v75.75,102.75 75,102 75,100.75 75.5,100 IC1.97 | v155,101.25 155,121.19 JP4.3
  Bottom 0.254: v155,101.25 148.25,101.25 146.25,103.25 76.25,103.25 v75.75,102.75
N$46  (via drill 0.51)
  Top 0.254: v76,101.5 IC1.96 | v138.75,101.25 138.75,122.44 JP3.10
  Bottom 0.254: v138.75,101.25 124.75,101.25 123.5,102.5 77,102.5 v76,101.5
N$47  (via drill 0.51)
  Top 0.254: v77.5,101.5 76.5,100.25 IC1.95 | v140,100 140,121.15 JP3.9
  Bottom 0.254: v140,100 124,100 122.5,101.5 v77.5,101.5
N$48  (via drill 0.51)
  Top 0.254: IC1.7 77.5,68 v78.25,68.75 | v132.5,68.75 132.5,121.19 JP3.3
  Bottom 0.254: v78.25,68.75 v132.5,68.75
N$49  (via drill 0.51)
  Top 0.254: v80,67.75 79,67.75 78.75,67.5 IC1.8 | v131.25,67.75 131.25,122.56 JP3.4
  Bottom 0.254: v131.25,67.75 130.75,68.25 80.5,68.25 v80,67.75
N$50
  Top 0.254: IC1.20 53,61.5 52.37,62.13 IC8.2
N$51  (via drill 0.51)
  Top 0.254: IC1.22 51,60.5 49.5,62 v49.5,94.5 | 51.75,93.09 IC8.20 51.72,94.47 v51.75,94.5
  Bottom 0.254: v49.5,94.5 v51.75,94.5
N$52
  Top 0.254: IC1.21 51.25,61 50,62.25 50,93.5 50.5,94 50.5,95 51,95.75 52.5,95.75 53,95.25 53,93.14 IC8.18 53,93.11
N$53  (via drill 0.51)
  Top 0.254: IC1.32 77,54.75 76,53.75 76,47.75 77.5,46.25 v77.5,44.75 | IC5.8 43.48,69.25 43.25,69 v43.25,44.75
  Bottom 0.254: v43.25,44.75 v77.5,44.75
N$54
  Top 0.254: R23.1 26.23,9.15 26.23,5.12 LED6.A
N$55  (via drill 0.51)
  Top 0.254: IC8.5 54.31,90.44 v54.25,90.5 | v59,90.5 C24.1
  Bottom 0.254: v54.25,90.5 v59,90.5
N$56  (via drill 0.51)
  Top 0.254: IC1.31 76.5,55 75.5,54 75.5,47.5 76.25,46.75 v76.25,46 | v48.5,46 v48.5,78.75 | v44.5,78.75 44.12,78.25 IC5.16
  Bottom 0.254: v48.5,46 v76.25,46 | v48.5,78.75 v44.5,78.75
N$57  (via drill 0.51)
  Top 0.254: IC1.30 76,55.25 75,54.25 75,45.5 75.75,44.5 v75.75,42.25 | v44.75,42.25 44.75,61 44.12,61.62 IC5.9
  Bottom 0.254: v44.75,42.25 v75.75,42.25
N$58  (via drill 0.51)
  Top 0.254: IC1.29 75.5,55.5 74.5,54.5 v74.5,43.5 | IC5.7 42.83,69.75 42.25,69 42.25,64.5 41.25,63.5 v41.25,43.5
  Bottom 0.254: v41.25,43.5 v74.5,43.5
N$59  (via drill 0.51)
  Top 0.254: v78,64 IC1.61 | v46.25,64 45.42,64.83 IC5.11
  Bottom 0.254: v46.25,64 v78,64
N$60
  Top 0.254: C17.1 43.48,78.38 IC5.17
N$61  (via drill 0.51)
  Top 0.254: IC1.37 79.5,39.5 v80,39
  Bottom 0.254: v80,39 89,39 90.25,37.75 99.25,37.75 99.96,38.46 JP5.7
N$62  (via drill 0.51)
  Top 0.254: IC1.38 80,41 v80.5,40.5
  Bottom 0.254: v80.5,40.5 88.75,40.5 90.75,38.5 97.75,38.5 98.75,39.5 98.75,42 99.25,42.5 101.23,42.5 JP5.9
N$63  (via drill 0.51)
  Top 0.254: v72.5,41.25 72.5,54 74.5,56 IC1.27
  Bottom 0.254: v72.5,41.25 77,41.25 78,42.25 89.5,42.25 91.75,40 93.65,40 JP5.3
N$64  (via drill 0.51)
  Top 0.254: v73.5,40.25 73.5,54.25 75,55.75 IC1.28
  Bottom 0.254: v73.5,40.25 77.25,40.25 78.5,41.5 89,41.5 91,39.5 95.69,39.5 JP5.5
N$65  (via drill 0.51)
  Top 0.254: JP5.4 95,43.85 v95,53.25 | v85.5,66.75 85.5,68.5 84.75,69.25 81.75,69.25 80.75,70.25 77,70.25 75.75,69 IC1.5
  Bottom 0.254: v95,53.25 95,66 94.5,66.5 85.75,66.5 v85.5,66.75
N$66  (via drill 0.51)
  Top 0.254: v91.5,54.25 91.75,54.5 96.75,54.5 97.5,53.75 97.5,43.85 JP5.6 | v83.75,66.75 83.75,67.75 83.25,68.25 81.5,68.25 80,69.75 77.5,69.75 76.25,68.5 IC1.6
  Bottom 0.254: v91.5,54.25 91.5,65 91,65.5 85,65.5 v83.75,66.75
N$67  (via drill 0.51)
  Top 0.254: IC1.47 84.5,55.5 87,53 87,38.5 86.75,38.25 86.75,35.5 v87.25,35 | v105,35 105,41.15 JP5.11
  Bottom 0.254: v87.25,35 v105,35
N$68  (via drill 0.51)
  Top 0.254: IC1.48 85,55.75 87.5,53.25 87.5,36.75 v87.75,36.5 | v107.75,36.5 107.75,41.1 JP5.13
  Bottom 0.254: v87.75,36.5 v107.75,36.5
N$69
  Top 0.254: IC1.49 85.5,56 85.75,55.75 99.25,55.75 100,55 100,43.81 JP5.8
N$70
  Top 0.254: IC1.50 86.5,57 87.25,56.25 101.75,56.25 102.5,55.5 JP5.10
N$71
  Top 0.254: IC1.51 89,59 90.75,57.25 104.25,57.25 105,56.5 105,43.85 JP5.12
N$72
  Top 0.254: IC1.52 89.5,59.5 91,58 106.75,58 107.5,57.25 107.5,43.89 JP5.14
N$73  (via drill 0.51)
  Top 0.254: IC5.5 41.5,70.81 41.5,67.5 40.75,66.75 v40.75,65.25 | v80.25,65.25 81,64.5 IC1.62
  Bottom 0.254: v40.75,65.25 v80.25,65.25
N$74  (via drill 0.51)
  Top 0.254: IC1.75 89.5,71 90,71.5 v90,82 | v102,82 102.09,82.34 IC6.2 | v87.25,82 87.11,82.36 IC7.3
  Bottom 0.254: v102,82 v90,82 v87.25,82
N$75  (via drill 0.51)
  Top 0.254: IC1.76 86,74.25 v86.75,75 | 105.91,87.16 IC6.5 105.91,75.16 arc-90 v105.75,75 | IC7.6 91,87.5 v91,75
  Bottom 0.254: v86.75,75 v91,75 v105.75,75
N$76  (via drill 0.51)
  Top 0.254: IC1.77 85.5,75.5 86,76 v88,76 | IC6.9 107.17,91.58 108,90.75 108.75,90.75 109.5,90 v109.5,76 | v96.25,76 v96.25,91.5 | v92.25,91.5 92.19,91.56 IC7.8
  Bottom 0.254: v88,76 v96.25,76 v109.5,76 | v96.25,91.5 v92.25,91.5
N$77  (via drill 0.51)
  Top 0.254: IC1.78 85,76.25 v85.75,77 | v98.5,77 v98.5,90.5 | v103.25,90.5 103.36,91.11 IC6.12 | v88.39,89.5 IC7.11 | v94.25,77 v94.25,89.5
  Bottom 0.254: v85.75,77 v94.25,77 v98.5,77 | v98.5,90.5 v103.25,90.5 | v94.25,89.5 v88.39,89.5
N$78  (via drill 0.51)
  Top 0.254: IC1.79 v84.5,81 84.58,81.08 IC7.1 | v100.75,81 100.83,81 IC6.1
  Bottom 0.254: v84.5,81 v100.75,81
N$79  (via drill 0.51)
  Top 0.254: v46.25,26.5 46.35,26.61 IC4.20 C2.1 46.35,35.4 45.5,36.25 42.15,36.25 C3.A | R23.2 R22.2 31.25,14.92 JP11.3
  Bottom 0.254: v46.25,26.5 51,26.5 51.5,26 51.5,17 51,16.5 32.25,16.5 31.33,15.83 JP11.3
N$80
  Top 0.254: IC4.22 45.05,26.55 44.25,25.75 38.5,25.75 37.5,24.75 37.5,2.5 36.5,1.75 29.75,1.75 28.75,2.5 28.75,4.75 LED6.K
N$81  (via drill 0.51)
  Top 0.254: IC1.60 81.5,63.5 80.75,62.75 v79.5,62.75 | v46.25,62.75 45.25,62.75 44.77,63.23 IC5.10
  Bottom 0.254: v46.25,62.75 v79.5,62.75
N$82  (via drill 0.51)
  Top 0.254: IC8.11 57.56,103.81 58.25,104.5 v58.25,113.25 | v88.75,113.25 88.75,122.56 JP8.4
  Bottom 0.254: v58.25,113.25 v88.75,113.25
N$83  (via drill 0.51)
  Top 0.254: IC8.7 55.62,84.39 56.25,83.75 60.75,83.75 61.25,84.25 v61.25,100.5 | v52.5,100.5 52.5,121.15 JP6.9
  Bottom 0.254: v61.25,100.5 v52.5,100.5
N$84  (via drill 0.51)
  Top 0.254: IC8.8 56.27,84.73 56.75,84.25 59.75,84.25 60.25,84.75 v60.25,99.5 | v54,99.5 54,122.44 JP6.10
  Bottom 0.254: v60.25,99.5 v54,99.5
N$85  (via drill 0.51)
  Top 0.254: IC8.14 55.62,119 v55.5,119 | v67.5,119 67.5,121.23 JP7.3
  Bottom 0.254: v55.5,119 v67.5,119
N$86  (via drill 0.51)
  Top 0.254: IC8.13 56.25,117 v57.25,118 | v66.25,118 66.25,122.56 JP7.4
  Bottom 0.254: v57.25,118 v66.25,118
N$87  (via drill 0.51)
  Top 0.254: IC8.9 56.91,90.92 58.25,92.25 58.25,103 59.25,104 v59.25,117 | v70,117 JP7.5
  Bottom 0.254: v59.25,117 v70,117
N$88  (via drill 0.51)
  Top 0.254: IC8.10 57.56,90.56 59,92 59,102.25 60.25,103.5 v60.25,116 | v68.75,116 68.75,122.52 JP7.6
  Bottom 0.254: v60.25,116 v68.75,116
N$89
  Top 0.254: IC5.23 39.58,114.33 40.25,115 43.75,115 44.96,116.21 JP6.3
N$90  (via drill 0.51)
  Top 0.254: IC8.12 56.91,113.92 v57.5,114.5 | v90,114.5 90,121.19 JP8.3
  Bottom 0.254: v57.5,114.5 v90,114.5
N$91  (via drill 0.51)
  Top 0.254: IC5.3 40.23,72.72 40.75,73.25 46.25,73.25 46.75,73.75 46.75,80.75 44.75,82.75 v44.75,112 | v72.5,112 72.5,121.25 72.52,121.23 JP7.7
  Bottom 0.254: v44.75,112 v72.5,112
N$92  (via drill 0.51)
  Top 0.254: IC5.4 40.88,72.12 41.25,72.5 47,72.5 47.5,73 47.5,81 46.25,82.25 v46.25,110.75 | v71.25,110.75 71.25,122.48 JP7.8
  Bottom 0.254: v46.25,110.75 v71.25,110.75
N$93
  Top 0.254: IC5.22 40.25,76.69 40.25,113.5 41,114.25 45.5,114.25 46.25,115 46.25,122.5 44.98,123.77 JP6.4
N$94  (via drill 0.51)
  Top 0.254: v124.25,20.5 124.25,32.39 | v107,20.5 107,21.85 R10.2 R11.2 R13.2 R12.2 | 124.25,39.75 C34.1
  Top 0.61: J5.4 124.25,32.39 124.25,37 | 124.25,37 124.25,39.75 L2.2 | 124.25,37 C32.A
  Bottom 0.254: v107,20.5 v124.25,20.5
N$95  (via drill 0.51)
  Top 0.254: IC1.80 84,77.25 v83.5,78 | v104.5,78 104.64,78.39 IC6.4 | IC7.4 88.39,78.5 v88.5,78
  Bottom 0.254: v83.5,78 v88.5,78 v104.5,78
N$96  (via drill 0.51)
  Top 0.254: IC1.81 83.5,76.75 82.25,78 v82.25,79 | v99.5,79 v99.5,89.5 | v105.75,89.5 105.75,93.09 IC6.10 | v89.66,90.5 IC7.10 | v95.25,79 v95.25,90.5
  Bottom 0.254: v82.25,79 v95.25,79 v99.5,79 | v99.5,89.5 v105.75,89.5 | v95.25,90.5 v89.66,90.5
N$97  (via drill 0.51)
  Top 0.254: IC1.82 83,76.5 81.25,78.25 v81.25,80 81.25,80.75 83.5,83 83.5,89.25 85.75,91.5 85.75,93.15 IC7.13 | IC6.13 102.09,91.59 v102.25,91.5 | v97.5,80 v97.5,91.5
  Bottom 0.254: v97.5,91.5 v102.25,91.5 | v81.25,80 v97.5,80
N$98
  Top 0.254: LED5.K 34.25,5 35.75,5 36.5,5.75 36.5,25.25 38,26.75 43.75,26.75 44.41,27.41 IC4.23
N$99  (via drill 0.51)
  Top 0.254: v103.5,83 103.5,87.5 IC6.3 | IC7.2 85.75,87.47 v85.75,83 | v47.5,83 JP6.5
  Bottom 0.254: v103.5,83 v85.75,83 v47.5,83
N$100  (via drill 0.51)
  Top 0.254: v107.25,84.25 107.25,87.5 IC6.6 | v89.75,84.25 89.75,87.47 IC7.5 | v48.5,84.25 48.25,84.5 48.25,96 48.75,96.5 48.75,122.52 JP6.6
  Bottom 0.254: v107.25,84.25 v89.75,84.25 v48.5,84.25
N$101  (via drill 0.51)
  Top 0.254: v108.5,98.25 108.44,98.25 IC6.8 | IC7.9 90.75,93.25 90.75,98 v90.5,98.25 | v50,98.25 50,121.19 JP6.7
  Bottom 0.254: v108.5,98.25 v90.5,98.25 v50,98.25
N$102  (via drill 0.51)
  Top 0.254: v87.11,97 IC7.12 | IC6.11 104.64,97 v104.5,97 | v51.25,97 51.25,122.48 JP6.8
  Bottom 0.254: v51.25,97 v87.11,97 v104.5,97
N$103
  Top 0.254: IC1.59 108.25,63 111.25,60 111.25,42.64 JP5.17
N$104
  Top 0.254: IC1.58 107.75,62.5 110,60.25 110,43.77 JP5.16
N$105
  Top 0.254: LED7.A 8.75,5.25 8.73,5.27 8.73,9.13 R24.1
N$106  (via drill 0.51)
  Top 0.254: IC4.2 41.8,23.7 41,24.5 v39.25,24.5 | v39.25,28 39.25,37.5 40.25,38.5 45.25,38.5 46.25,39.5 C31.2
  Bottom 0.254: v39.25,24.5 v39.25,28
N$107
  Top 0.813: D1.A J1.PWR
N$108
  Top 0.813: IC3.3 31.25,102.31 D1.C 31.25,105.5 35,105.5 C25.A
N$109
  Top 0.813: IC3.2 JP10.1
N$110
  Top 0.254: IC12.2 85.72,20.95 85.09,20.32 85.09,17.78 | 85.09,17.78 85.09,15.56 84.45,14.92 83.5,14.92 82.77,14.19 J4.2 | 85.09,17.78 R28.1
N$111
  Top 0.254: IC12.7 83.19,20.95 83.82,20.32 83.82,17.78 | 83.82,17.78 83.82,16.19 83.19,15.56 82.23,15.56 81.38,14.71 J4.7 | 83.82,17.78 R29.1
N$112
  Top 0.254: J4.3 80.01,14.61 79.06,15.56 76.83,15.56 76.2,16.19 76.2,17.78 | IC13.2 76.83,20.95 76.2,20.32 76.2,17.78 | 76.2,17.78 R30.1
N$113
  Top 0.254: IC14.2 67.94,20.95 67.31,20.32 67.31,17.78 | 67.31,17.78 67.31,14.92 67.94,14.29 76.52,14.29 77.23,13.57 J4.4 | 67.31,17.78 R32.1
N$114
  Top 0.254: IC14.7 65.41,20.95 66.04,20.32 66.04,17.78 | 66.04,17.78 66.04,14.29 66.67,13.65 75.25,13.65 75.85,13.05 J4.9 | 66.04,17.78 R33.1
N$115
  Top 0.254: IC13.7 74.3,20.95 74.93,20.32 74.93,17.78 | 74.93,17.78 74.93,15.56 75.56,14.92 77.79,14.92 78.62,14.09 J4.8 | 74.93,17.78 R31.1
N$116
  Top 0.254: IC11.7 92.39,20.95 93.03,20.32 93.03,17.78 | 93.03,17.78 93.03,14.92 92.39,14.29 84.77,14.29 84.15,13.66 J4.6 | 93.03,17.78 R27.1
N$117
  Top 0.254: IC11.2 95.25,20.95 94.3,20 94.3,17.78 | 94.3,17.78 94.3,14.29 93.66,13.65 86.36,13.65 85.54,12.83 J4.1 | 94.3,17.78 R26.1
N$118
  Top 0.254: IC15.1 73.23,30.74 R25.1
PDI-DATA  (via drill 0.51)
  Top 0.254: IC1.89 79.5,74.25 v80,74.75 | v67.5,74.75 67.5,82.75 63.5,86.75 63.5,88.69 JP2.1
  Bottom 0.254: v67.5,74.75 v80,74.75
RESET  (via drill 0.51)
  Top 0.254: IC1.90 79,75.25 v79.5,75.75 | v68.5,75.75 68.5,88.69 JP2.5 67.25,90.02 67.25,97.75 66.5,98.5 63.75,98.5 62.75,99.5 S1.4 S1.3 | v62.5,77 R9.1 | v47.25,71 47.5,70.75 47.5,60 46.25,58.75 C31.1
  Bottom 0.254: v79.5,75.75 v68.5,75.75 62.5,75.75 | 62.5,75.75 62,75.25 58.75,75.25 57.5,74 JP1.6 47.75,74 47.25,73.5 v47.25,71 | 62.5,75.75 v62.5,77
SCL0  (via drill 0.51)
  Top 0.254: IC11.6 92.39,22.23 93.03,22.86 93.03,25.4 | 93.03,25.4 v93.03,27.75 93.03,28.26 92.39,28.89 82.23,28.89 81.64,29.49 IC15.8 | 93.03,25.4 R2.1 | JP7.9 75,121.15 v75,117.5 | v120.75,26.5 v120.5,117.5
  Bottom 0.254: v120.5,117.5 v75,117.5 | v93.03,27.75 98.25,27.75 99.5,26.5 v120.75,26.5
SCL0-3.3  (via drill 0.51)
  Top 0.254: IC1.16 75.5,63.5 78,61 v83.75,61 | IC15.13 81.64,37.38 82,37.75 82,42.75 v82.75,43.5 | v89.75,43.5 v89.75,52.75
  Bottom 0.254: v83.75,61 86.75,61 87.5,60.25 87.5,53.48 88.25,52.75 v89.75,52.75 | v82.75,43.5 v89.75,43.5
SCL1  (via drill 0.51)
  Top 0.254: IC11.3 94.93,22.23 94.3,22.86 v94.3,24.26 94.3,25.4 | 94.3,25.4 94.3,28.89 93.66,29.53 82.87,29.53 82.28,30.11 IC15.9 | 94.3,25.4 R1.1
  Bottom 0.254: v94.3,24.26 99.99,24.26 100.75,23.5 100.75,20.25 101.5,19.5 128.25,19.5 129.75,21 161.75,21 162.58,21.83 JP4.9
SCL1-3.3  (via drill 0.51)
  Top 0.254: IC1.26 74,56.25 71.5,53.75 v71.5,35 | IC15.12 82.28,35.28 v82,35
  Bottom 0.254: v71.5,35 v82,35
SCL2
  Top 0.254: IC13.3 76.83,22.23 76.2,22.86 76.2,25.4 | 76.2,25.4 76.2,26.99 76.83,27.62 79.06,27.62 79.69,28.25 IC15.5 | 76.2,25.4 R5.1
SCL2-3.3
  Top 0.254: IC1.36 79,38.25 79.69,37.56 IC15.16
SCL3
  Top 0.254: IC12.6 83.19,22.23 83.82,22.86 83.82,25.4 | 83.82,25.4 83.82,26.99 83.19,27.62 80.96,27.62 80.33,28.25 IC15.6 | 83.82,25.4 R4.1
SCL3-3.3  (via drill 0.51)
  Top 0.254: IC1.46 84,55.25 86,53.25 v86,44.5 | IC15.15 80.33,37.09 81.5,38.25 81.5,43.5 82.5,44.5 v83.5,44.5
  Bottom 0.254: v83.5,44.5 v86,44.5
SDA0  (via drill 0.51)
  Top 0.254: IC13.6 74.3,22.23 74.93,22.86 74.93,25.4 | 74.93,25.4 74.93,27.62 v75.03,27.72 75.56,28.26 78.42,28.26 79.03,28.87 IC15.4 | 74.93,25.4 R6.1 | JP7.10 73.75,122.44 v73.75,116 | v118,27.75 v118,116
  Bottom 0.254: v118,116 v73.75,116 | v118,27.75 111.75,27.75 109.5,29.75 89.5,29.75 87.5,27.75 75.06,27.75 v75.03,27.72
SDA0-3.3  (via drill 0.51)
  Top 0.254: IC1.15 75.75,64 78.25,61.5 82.25,61.5 83,62.25 v85.5,62.25 | v88.75,54.25 88.75,32.5 88.25,32 80.03,32 79.03,33 IC15.17
  Bottom 0.254: v85.5,62.25 88,62.25 88.75,61.5 v88.75,54.25
SDA1  (via drill 0.51)
  Top 0.254: IC12.3 85.72,22.23 85.09,22.86 v85.09,24.24 85.09,25.4 | 85.09,25.4 85.09,27.62 84.45,28.26 81.6,28.26 80.98,28.87 IC15.7 | 85.09,25.4 R3.1
  Bottom 0.254: v85.09,24.24 85.1,24.25 89.25,24.25 90,23.5 90,19.25 90.75,18.5 129,18.5 130.5,20 163.25,20 164,20.75 164,122.35 JP4.10
SDA1-3.3  (via drill 0.51)
  Top 0.254: IC1.25 70.75,59 70.25,58.5 v70.25,34 | IC15.14 81,36.56 v81,34
  Bottom 0.254: v70.25,34 v81,34
SDA2
  Top 0.254: IC14.3 67.94,22.23 67.31,22.86 67.31,25.4 | 67.31,25.4 67.31,28.26 67.94,28.89 77.79,28.89 78.39,29.49 IC15.3 | 67.31,25.4 R7.1
SDA2-3.3
  Top 0.254: IC1.35 78.5,37.25 78.39,37.13 IC15.18
SDA3
  Top 0.254: IC14.6 65.41,22.23 66.04,22.86 66.04,25.4 | 66.04,25.4 66.04,28.89 66.67,29.53 77.15,29.53 77.73,30.11 IC15.2 | 66.04,25.4 R8.1
SDA3-3.3  (via drill 0.51)
  Top 0.254: IC1.45 83.5,55 85.25,53.25 85.25,47.75 v84.75,47.25 | v77,43.25 77,39 77.73,38.27 IC15.19
  Bottom 0.254: v84.75,47.25 80.25,47.25 79.75,46.75 79.75,44.25 79.25,43.75 77.5,43.75 v77,43.25

## Text on the board
tPlace: J2 | PANEL 1A | PANEL 1B | PANEL 1C | PANEL 2A | PANEL 2B | JP6 | JP7 | JP8 | JP3 | JP4 | J1 | S1 | -12V | +12V | +5V | GND | D1 | IC3 | C25 | C5 | C4 | C26 | RESET | JP10 | C29 | ISP | C16 | C27 | C28 | C19 | IC9 | IC8 | Q1 | IC7 | IC6 | C24 | IC2 | JP2 | C22 | C20 | C30 | C17 | C35 | R15 | L1 | C14 | R9 | C21 | C23 | C6 | R14 | IC5 | JTAG | R17 | C36 | C13 | R16 | DC1 | JP1 | C7 | C12 | IC10 | C11 | C18 | C8 | IC1 | C31 | C9 | C10 | C33 | EXPANSION | L2 | C34 | JP12 | C38 | JP5 | Parallel TWI-bus Panel Controller | JF-MR-PC0003 Rev C | Howard Hughes Medical Institute 2010 | C3 | C32 | C37 | C2 | C1 | R25 | IC15 | R12 | R3 | R2 | R1 | R7 | R6 | R5 | R4 | R13 | R8 | R11 | IC4 | R10 | C15 | IC14 | IC13 | IC12 | IC11 | R33 | R32 | R31 | R30 | R29 | R28 | R27 | R26 | JP11 | R18 | R19 | R20 | R21 | R24 | R23 | R22 | J3 | J4 | LED7 | LED6 | LED5 | LED1 | LED2 | LED3 | LED4 | J5 | USB | TWI | SD